# Altium schematic sheet Fleet-Monitor-MCU.SchDoc: Fleet Monitor
size A4; Subtitle: Microcontroller; DocumentNumber: 2; Revision: V1.0; SheetNumber: 3; SheetTotal: 8; Author: Florian Baumgartner & Luca Jost
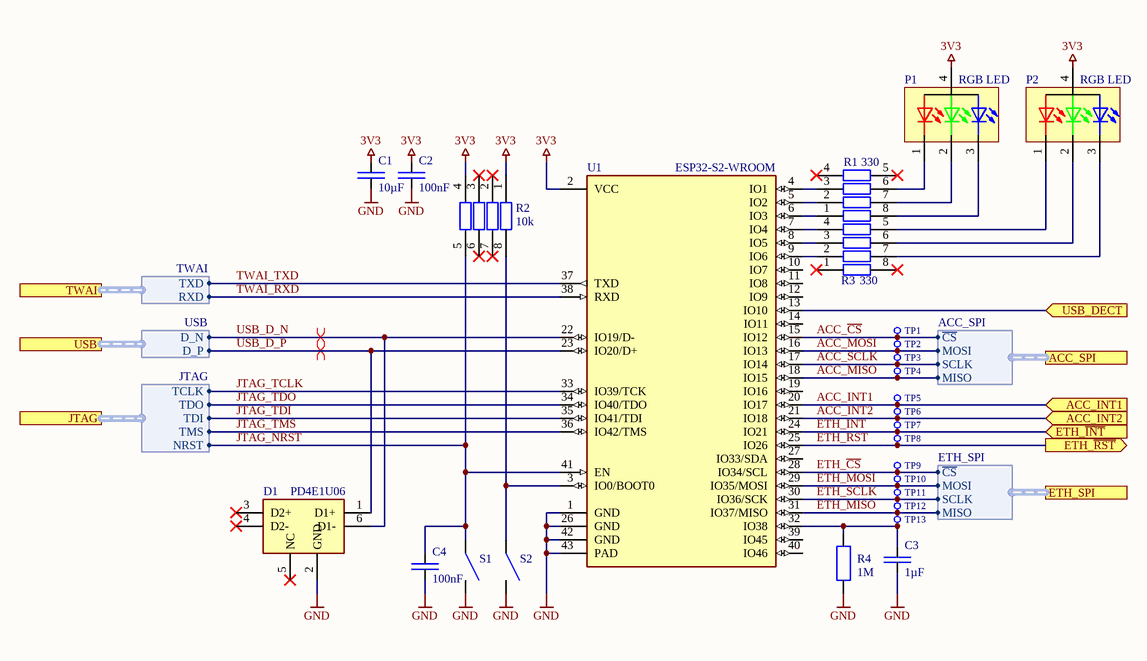
[diagram p0: Fleet-Monitor-MCU.SchDoc]

## Parts
C1  10µF  [SMD Keramikkondensator 0603]
C2  100nF  [SMD Keramikkondensator 0603]
C3  1µF  [SMD Keramikkondensator 0603]
C4  100nF  [SMD Keramikkondensator 0603]
D1  PD4E1U06  [SMD IC SOT-363 (SC-70-6)]
P1  RGB LED  [SMD LED PLCC-4]
P2  RGB LED  [SMD LED PLCC-4]
R1  330  [SMD Widerstand Array 4-Fach 0603]
R2  10k  [SMD Widerstand Array 4-Fach 0603]
R3  330  [SMD Widerstand Array 4-Fach 0603]
R4  1M  [SMD Widerstand 0603]
S1  SMD-Button  [SMD Button 5.2x5.2]  (value not drawn)
S2  SMD-Button  [SMD Button 5.2x5.2]  (value not drawn)
TP1  X-TP  [SMD Testpunkt Ø1mm]  (value not drawn)  (no BOM)
TP2  X-TP  [SMD Testpunkt Ø1mm]  (value not drawn)  (no BOM)
TP3  X-TP  [SMD Testpunkt Ø1mm]  (value not drawn)  (no BOM)
TP4  X-TP  [SMD Testpunkt Ø1mm]  (value not drawn)  (no BOM)
TP5  X-TP  [SMD Testpunkt Ø1mm]  (value not drawn)  (no BOM)
TP6  X-TP  [SMD Testpunkt Ø1mm]  (value not drawn)  (no BOM)
TP7  X-TP  [SMD Testpunkt Ø1mm]  (value not drawn)  (no BOM)
TP8  X-TP  [SMD Testpunkt Ø1mm]  (value not drawn)  (no BOM)
TP9  X-TP  [SMD Testpunkt Ø1mm]  (value not drawn)  (no BOM)
TP10  X-TP  [SMD Testpunkt Ø1mm]  (value not drawn)  (no BOM)
TP11  X-TP  [SMD Testpunkt Ø1mm]  (value not drawn)  (no BOM)
TP12  X-TP  [SMD Testpunkt Ø1mm]  (value not drawn)  (no BOM)
TP13  X-TP  [SMD Testpunkt Ø1mm]  (value not drawn)  (no BOM)
U1  ESP32-S2-WROOM  [SMD ESP32-S2-WROOM]

## Ports
ACC_INT1 (in), ACC_INT2 (in), ACC_SPI (harness ACC_SPI), ETH_SPI (harness ETH_SPI), ETH_~{INT} (in), ETH_~{RST} (out), JTAG (harness JTAG), TWAI (harness TWAI), USB (harness USB), USB_DECT (in)

## Harnesses
USB: D_P, D_N
JTAG: TMS, TDI, TDO, TCLK, NRST
ETH_SPI: SCLK, MOSI, MISO, ~{CS}
TWAI: TXD, RXD
ACC_SPI: SCLK, MOSI, MISO, ~{CS}

## Nets
3V3: C1.2 C2.2 P1.4 P2.4 R2.1 R2.4 U1.2(VCC)
GND: C1.1 C2.1 C3.1 C4.1 D1.2(GND) R4.2 S1.2 S2.2 U1.1(GND) U1.26(GND) U1.42(GND) U1.43(PAD)
ACC_~{CS}: TP1.1 U1.15(IO12) ; port ACC_SPI.~{CS}
ACC_INT1: TP5.1 U1.20(IO17) ; port ACC_INT1
ACC_INT2: TP6.1 U1.21(IO18) ; port ACC_INT2
ACC_MISO: TP4.1 U1.18(IO15) ; port ACC_SPI.MISO
ACC_MOSI: TP2.1 U1.16(IO13) ; port ACC_SPI.MOSI
ACC_SCLK: TP3.1 U1.17(IO14) ; port ACC_SPI.SCLK
ETH_~{CS}: TP9.1 U1.28(IO34/SCL) ; port ETH_SPI.~{CS}
ETH_~{INT}: TP7.1 U1.24(IO21) ; port ETH_~{INT}
ETH_MISO: TP12.1 U1.31(IO37/MISO) ; port ETH_SPI.MISO
ETH_MOSI: TP10.1 U1.29(IO35/MOSI) ; port ETH_SPI.MOSI
ETH_~{RST}: TP8.1 U1.25(IO26) ; port ETH_~{RST}
ETH_SCLK: TP11.1 U1.30(IO36/SCK) ; port ETH_SPI.SCLK
JTAG_NRST: C4.2 R2.5 S1.1 U1.41(EN) ; port JTAG.NRST
JTAG_TCLK: U1.33(IO39/TCK) ; port JTAG.TCLK
JTAG_TDI: U1.35(IO41/TDI) ; port JTAG.TDI
JTAG_TDO: U1.34(IO40/TDO) ; port JTAG.TDO
JTAG_TMS: U1.36(IO42/TMS) ; port JTAG.TMS
TWAI_RXD: U1.38(RXD) ; port TWAI.RXD
TWAI_TXD: U1.37(TXD) ; port TWAI.TXD
USB_D_N: D1.6(D1-) U1.22(IO19/D-) ; port USB.D_N
USB_D_P: D1.1(D1+) U1.23(IO20/D+) ; port USB.D_P
USB_DECT: U1.13(IO10) ; port USB_DECT
NetC3_2: C3.2 R4.1 TP13.1 U1.32(IO38)
NetP1_1: P1.1 R1.6
NetP1_2: P1.2 R1.7
NetP1_3: P1.3 R1.8
NetP2_1: P2.1 R3.5
NetP2_2: P2.2 R3.6
NetP2_3: P2.3 R3.7
NetR1_1: R1.1 U1.6(IO3)
NetR1_2: R1.2 U1.5(IO2)
NetR1_3: R1.3 U1.4(IO1)
NetR2_8: R2.8 S2.1 U1.3(IO0/BOOT0)
NetR3_2: R3.2 U1.9(IO6)
NetR3_3: R3.3 U1.8(IO5)
NetR3_4: R3.4 U1.7(IO4)

Not connected (* = marked no-connect by the designer): D1 3(D2+)* 4(D2-)* 5(NC)*; R1 4* 5*; R2 2* 3* 6* 7*; R3 1* 8*; U1 10(IO7) 11(IO8) 12(IO9) 14(IO11) 19(IO16) 27(IO33/SDA) 39(IO45) 40(IO46)

## Layout directives
differential pair: USB_D_N, USB_D_P

## Notes on the sheet
- Title
- Author:
- Subtitle
- Date:
- Rev:
- File:
- Sheet
- of

## Library data of the parts
C1 = E6 - 10uF: SMD Ceramic Capacitor E6; Component Value: 10µF 10V; Component Description: Multilayer Ceramic Capacitors MLCC; ComponentLink1Description: Datasheet; ComponentLink1URL: https://datasheet.lcsc.com/lcsc/1810191219_Samsung-Electro-Mechanics-CL10A106KP8NNNC_C19702.pdf; Digikey: 587-3258-1-ND; Farnell: 2113070; JLC-Parts: C19702; Mouser: 963-LMK107BBJ106MALT; Unit Price: 0.01
C2 C4 = E6 - 100nF: SMD Ceramic Capacitor E6; Component Value: 100nF 50V; Component Description: Multilayer Ceramic Capacitors MLCC; ComponentLink1Description: Datasheet; ComponentLink1URL: https://datasheet.lcsc.com/lcsc/1809301912_YAGEO-CC0603KRX7R9BB104_C14663.pdf; Digikey: 445-6899-1-ND; Farnell: 2210822; JLC-Parts: C14663; Mouser: 810-CGA2B3X7R1H104K; Unit Price: 0.01
C3 = E6 - 1uF: SMD Ceramic Capacitor E6; Component Value: 1µF 50V; Component Description: Multilayer Ceramic Capacitors MLCC; ComponentLink1Description: Datasheet; ComponentLink1URL: https://datasheet.lcsc.com/lcsc/1810261812_Samsung-Electro-Mechanics-CL10A105KB8NNNC_C15849.pdf; Digikey: 1276-1860-1-ND; Farnell: 3013383; JLC-Parts: C15849; Mouser: 187-CL10A105KB8NNNC; Unit Price: 0.01
D1 = PD4E1U06DCKR: Unidirectional 3A (8/20us) 15V (Typ) 6.5V 5.5V (Max) SOT-363 ESD Protection Devices ROHS; Component Description: ESD Suppressor; ComponentLink1Description: Datasheet; ComponentLink1URL: https://datasheet.lcsc.com/lcsc/1810172210_Texas-Instruments-TPD4E1U06DCKR_C194628.pdf; Component Value: PD4E1U06; Digikey: 296-39347-1-ND; Farnell: 3116516; JLC-Parts: C194628; Mouser: 595-TPD4E1U06DCKR; Unit Price: 0.12
P1 P2 = RGB LED: Component Value: 67-23/R6GHBHC-B01/2T; ComponentLink1Description: Datasheet; ComponentLink1URL: https://datasheet.lcsc.com/lcsc/2104061938_Everlight-Elec-67-23-R6GHBHC-B01-2T_C264607.pdf; Digikey: VAOS-SP4RGB4CT-ND; JLC-Parts: C264607; Mouser: 593-VAOS-SP4RGB4; Unit Price: 0.19; Component Description: RGB LED
R1 R3 = R-Array Single Quad E24 - 330: Isolated Resistor Array; Component Value: 330 (4x, 50V, 62.5mW, 5%); ComponentLink1Description: Datasheet; ComponentLink1URL: https://datasheet.lcsc.com/lcsc/1810170717_UNI-ROYAL-Uniroyal-Elec-4D03WGJ0331T5E_C12018.pdf; Digikey: Y4331CT-ND; Farnell: 2060160; JLC-Parts: C12018; Mouser: 667-EXB-V8V331JV; Unit Price: 0.01; Component Description: Isolated Resistor Array
R2 = R-Array Single Quad E24 - 10k: Isolated Resistor Array; Component Value: 10k (4x, 50V, 62.5mW, 5%); ComponentLink1Description: Datasheet; ComponentLink1URL: https://datasheet.lcsc.com/lcsc/1810191515_UNI-ROYAL-Uniroyal-Elec-4D03WGJ0103T5E_C29718.pdf; Digikey: Y4103CT-ND; Farnell: 2060167; JLC-Parts: C29718; Mouser: 667-EXB-V8V103JV; Unit Price: 0.01; Component Description: Isolated Resistor Array
R4 = E96 - 1M: SMD Chip Resistor E24; Component Value: 1M (75V, 100mW, 1%); ComponentLink1Description: Datasheet; ComponentLink1URL: https://datasheet.lcsc.com/lcsc/1810200710_UNI-ROYAL-Uniroyal-Elec-0603WAF4701T5E_C23162.pdf; Digikey: P1.00MHCT-ND; Farnell: 2303325; JLC-Parts: C22935; Mouser: 667-ERJ-3EKF1004V; Unit Price: 0.01; Component Description: Chip Resistor
S1 S2 = Button 3mmx2.5mm: Button SPST; Component Value: TS-1187A-B-A-B; Component Description: Tactile Switch; Digikey: CKN12221-1-ND; ComponentLink1Description: Datasheet; ComponentLink1URL: https://datasheet.lcsc.com/lcsc/2002271431_XKB-Connectivity-TS-1187A-B-A-B_C318884.pdf; Farnell: 3780596; JLC-Parts: C318884; Mouser: 611-PTS526SK15SMR2L; Unit Price: 0.02
TP1-TP13 = X-TP: Testpunkt; Component Value: Ø 0.8mm; Component Description: Testpoint; Unit Price: 0.00
U1 = ESP32-S2-WROOM: WiFi 802.11b/g/n Transceiver Module 2.4GHz Antenna, I-PEX Surface Mount; Component Description: Xtensa single-core 32-bit LX7 MCU; ComponentLink1Description: Datasheet; ComponentLink1URL: https://www.espressif.com/sites/default/files/documentation/esp32-s2-wroom_esp32-s2-wroom-i_datasheet_en.pdf; Digikey: 1965-ESP32-S2-WROOMTR-ND; Component Value: ESP32-S2-WROOM; JLC-Parts: C967026; Mouser: 356-ESP32S2WRMI320UH; Unit Price: 2.54